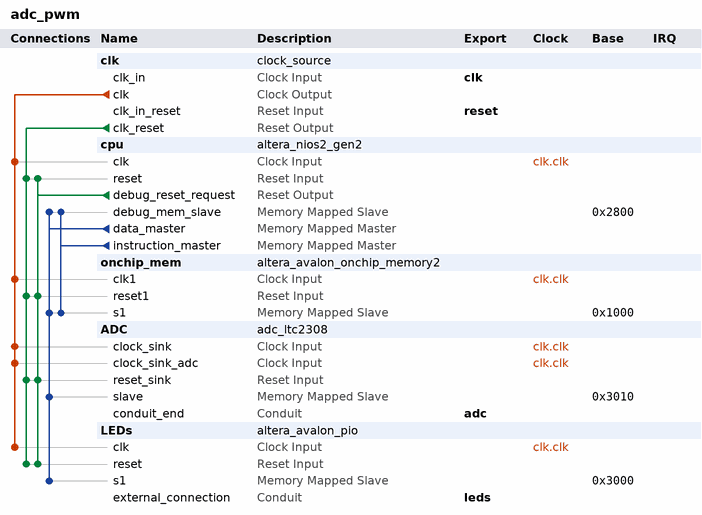
[diagram p0: system contents]
# Platform Designer (Qsys) system adc_pwm, Cyclone V 5CSEBA6U23I7
# Parameters at their usual value, and those the tool derives, are not listed.
package require -exact qsys 17.0
create_system adc_pwm
set_project_property DEVICE_FAMILY {Cyclone V}
set_project_property DEVICE 5CSEBA6U23I7

add_instance clk clock_source 17.0
set_instance_parameter_value clk clockFrequency 50000000

add_instance cpu altera_nios2_gen2 17.0
set_instance_parameter_value cpu dcache_size 2048
set_instance_parameter_value cpu exceptionSlave onchip_mem.s1
set_instance_parameter_value cpu icache_size 4096
set_instance_parameter_value cpu impl Fast
set_instance_parameter_value cpu resetSlave onchip_mem.s1

add_instance onchip_mem altera_avalon_onchip_memory2 17.0
set_instance_parameter_value onchip_mem dataWidth 32
set_instance_parameter_value onchip_mem dualPort false
set_instance_parameter_value onchip_mem initMemContent true
set_instance_parameter_value onchip_mem initializationFileName onchip_mem.hex
set_instance_parameter_value onchip_mem memorySize 4096

add_instance ADC adc_ltc2308 1.1

add_instance LEDs altera_avalon_pio 17.0
set_instance_parameter_value LEDs direction Output
set_instance_parameter_value LEDs width 8

# connections
add_connection clk.clk ADC.clock_sink clock
add_connection clk.clk ADC.clock_sink_adc clock
add_connection clk.clk cpu.clk clock
add_connection clk.clk LEDs.clk clock
add_connection clk.clk onchip_mem.clk1 clock
add_connection clk.clk_reset ADC.reset_sink reset
add_connection clk.clk_reset cpu.reset reset
add_connection clk.clk_reset LEDs.reset reset
add_connection clk.clk_reset onchip_mem.reset1 reset
add_connection cpu.debug_reset_request ADC.reset_sink reset
add_connection cpu.debug_reset_request cpu.reset reset
add_connection cpu.debug_reset_request LEDs.reset reset
add_connection cpu.debug_reset_request onchip_mem.reset1 reset
add_connection cpu.data_master ADC.slave avalon
set_connection_parameter_value cpu.data_master/ADC.slave baseAddress 0x3010
add_connection cpu.data_master cpu.debug_mem_slave avalon
set_connection_parameter_value cpu.data_master/cpu.debug_mem_slave baseAddress 0x2800
add_connection cpu.data_master LEDs.s1 avalon
set_connection_parameter_value cpu.data_master/LEDs.s1 baseAddress 0x3000
add_connection cpu.data_master onchip_mem.s1 avalon
set_connection_parameter_value cpu.data_master/onchip_mem.s1 baseAddress 0x1000
add_connection cpu.instruction_master cpu.debug_mem_slave avalon
set_connection_parameter_value cpu.instruction_master/cpu.debug_mem_slave baseAddress 0x2800
add_connection cpu.instruction_master onchip_mem.s1 avalon
set_connection_parameter_value cpu.instruction_master/onchip_mem.s1 baseAddress 0x1000

# exported interfaces
add_interface adc conduit end
set_interface_property adc EXPORT_OF ADC.conduit_end
add_interface clk clock sink
set_interface_property clk EXPORT_OF clk.clk_in
add_interface leds conduit end
set_interface_property leds EXPORT_OF LEDs.external_connection
add_interface reset reset sink
set_interface_property reset EXPORT_OF clk.clk_in_reset

set_interconnect_requirement {$system} qsys_mm.clockCrossingAdapter HANDSHAKE
set_interconnect_requirement {$system} qsys_mm.enableEccProtection FALSE
set_interconnect_requirement {$system} qsys_mm.insertDefaultSlave FALSE
set_interconnect_requirement {$system} qsys_mm.maxAdditionalLatency 1

save_system adc_pwm.qsys
